# EAGLE design SparkFun_LilyPad-Button (EAGLE 7.2.0)
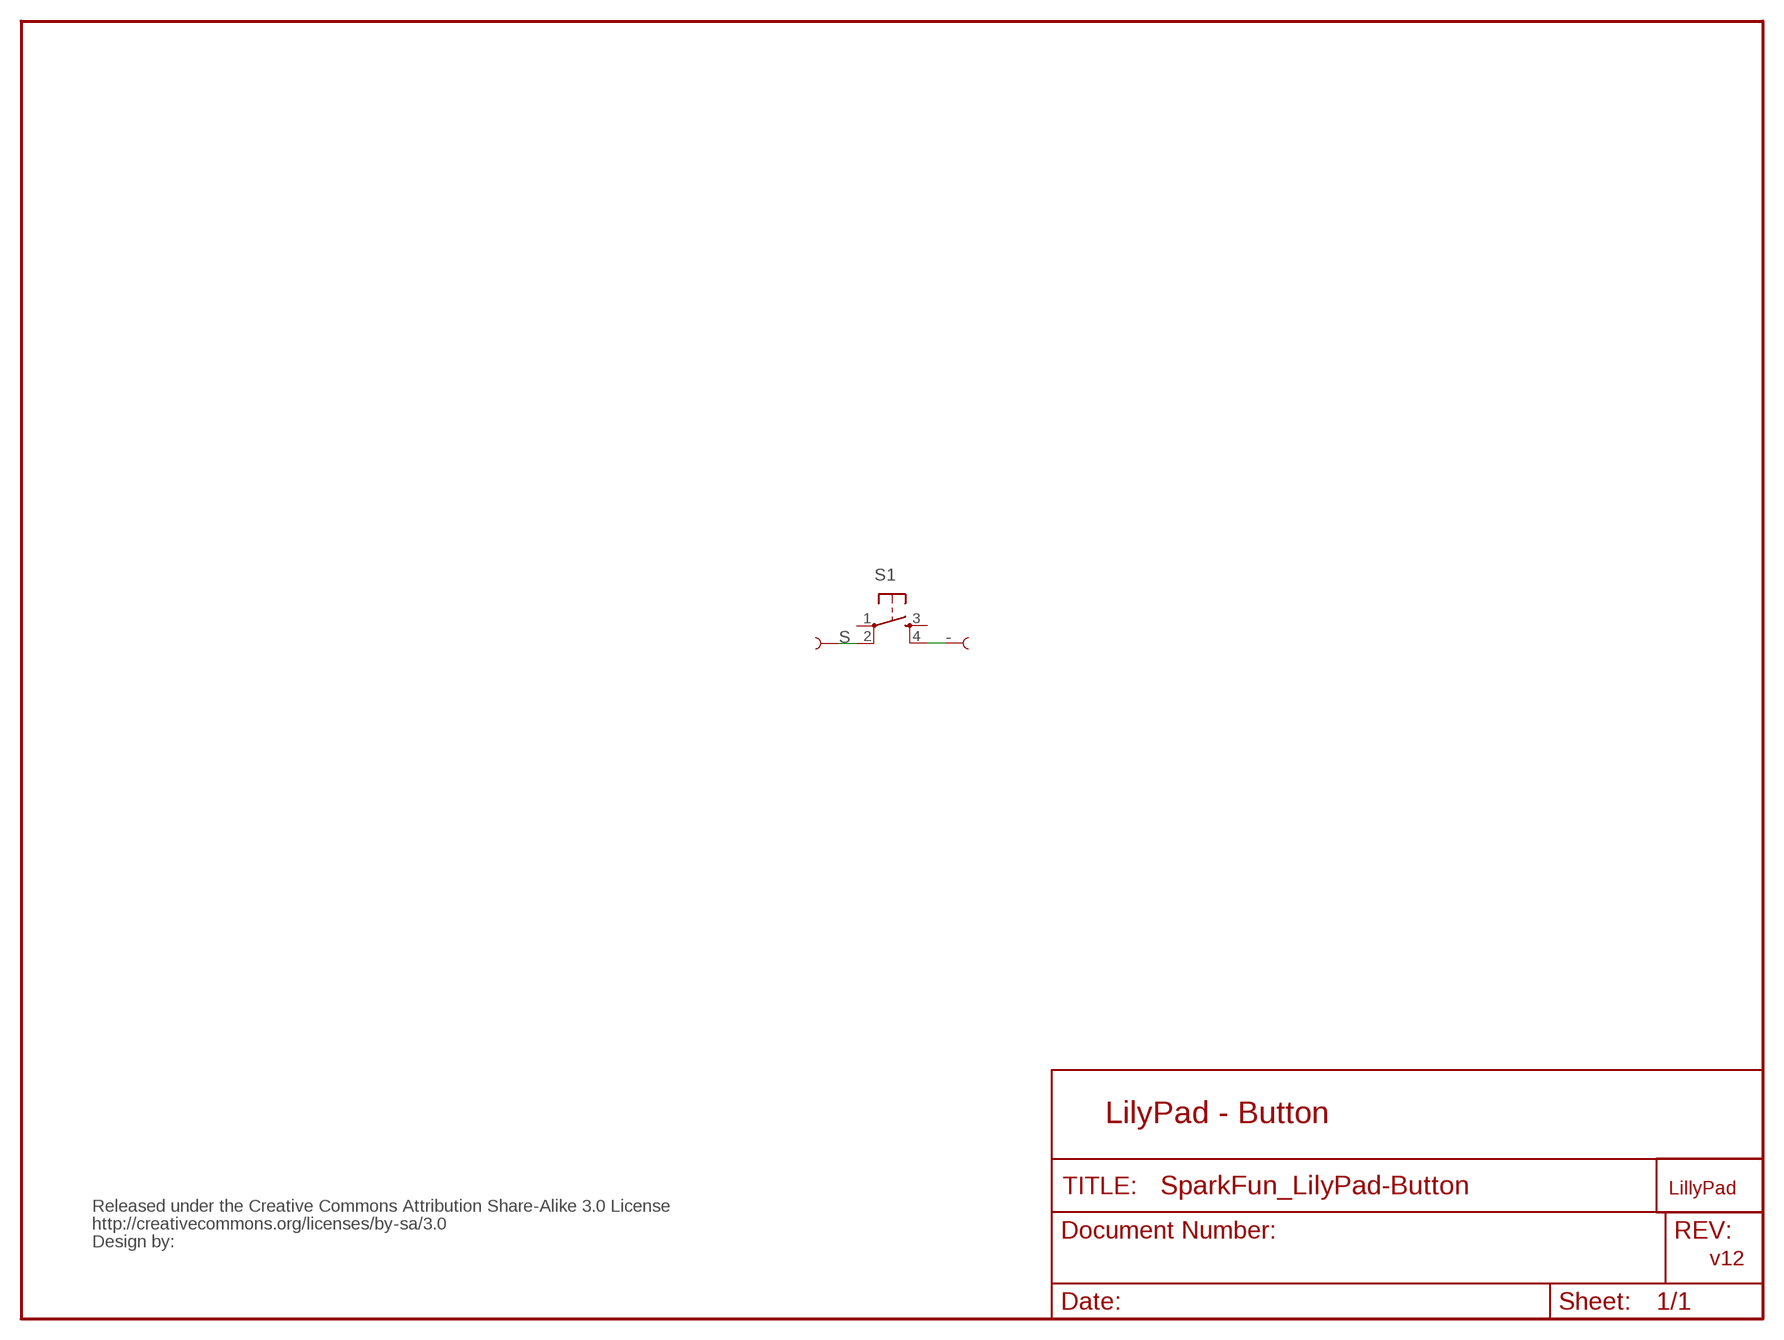
[diagram p0: schematic, sheet 1]

## Parts
BUTTON-  SEWTAP8  [PETAL-MEDIUM-2SIDE]
BUTTONS  SEWTAP8  [PETAL-MEDIUM-2SIDE]
LOGO1  LOGO-LPL  [LOGO-L]
S1  TAC_SWITCHSMD  [TACTILE_SWITCH_SMD]
U$1  CREATIVE_COMMONS  [CREATIVE_COMMONS]

## Nets
-: BUTTON-.1 S1.4
S: BUTTONS.1 S1.2
Unconnected: S1.1 S1.3

## Notes on the sheet
- LilyPad - Button
- v12

## Library data of the parts
BUTTON- BUTTONS = LilyPad-Wearables:SEWTAP
LOGO1 = LilyPad-Wearables:LOGO-LP
S1 = SparkFun:TAC_SWITCH: Momentary Switch Button commonly used for reset or general input. Spark Fun Electronics SKU : COM-00097
U$1 = SparkFun:CREATIVE_COMMONS

## Board
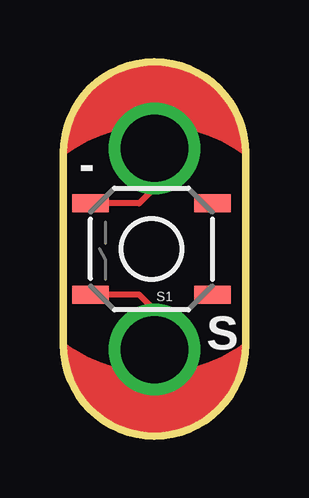
[diagram p1: board, top side]
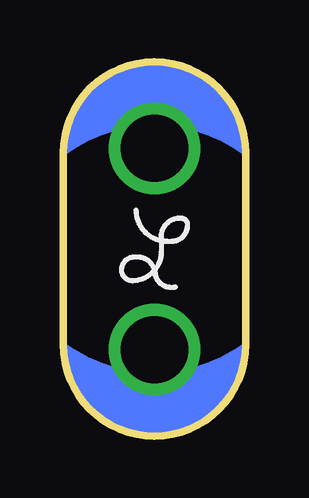
[diagram p2: board, bottom side, seen from below]

Size 7.6 x 15.6 mm. Coordinates in mm from the lower left corner, seen from the top.
Outline: 0,11.8 arc-180 7.6,11.8 7.6,3.8 arc-180 0,3.8 0,11.8
Copper layers (1*16): Top 0.035mm / dielectric 1.5mm / Bottom 0.035mm
Design rules "SparkFun": minimum track width 8mil, minimum drill 20mil, track to track 8mil, track to pad 8mil, pad to pad 8mil, via to via 8mil, smd to smd 8mil, copper to edge 8mil, drill to drill 8mil, minimum pad ring 12mil, minimum via ring 10mil, stop-mask expansion 4mil, vias tented up to drill 20mil, thermal gap 10mil

### Footprints (pad centres in the part's own frame; a part is rotated, then mirrored left to right if it is on the bottom)
PETAL-MEDIUM-2SIDE = drill 2.794: 1 0,-0.254
TACTILE_SWITCH_SMD = smd 1.524 x 0.762: 1 -2.54,1.905; 2 2.54,1.905; 3 -2.54,-1.905; 4 2.54,-1.905

### Placement (x,y rotation side)
BUTTON-  3.8,11.74 180 top
BUTTONS  3.8,3.86 0 top
LOGO1  3.8,7.8 0 bottom
S1  3.67,7.8 180 top
U$1  -25.41,-8.71 0 top  (outside the outline)

### Tracks (layer width: path | path; a pad name or v marks a point on that pad's centre or on a via)
-
  Top 0.254: S1.4 3.17,9.7 3.8,10.34 BUTTON-.1
S
  Top 0.254: S1.2 3.17,5.89 3.8,5.26 BUTTONS.1

### Text on the board
tPlace: - | S